# EAGLE schematic module_template_core (EAGLE 5.10)
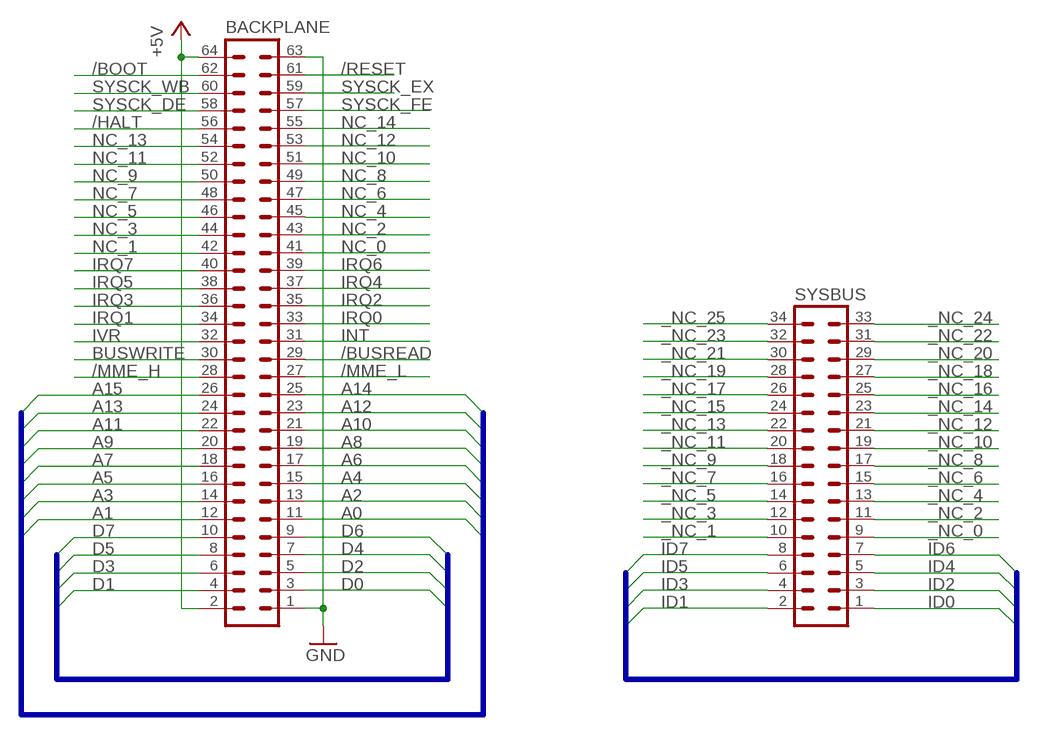
[diagram p0: schematic, sheet 1]

## Parts
BACKPLANE  ML64L  [ML64L]
SYSBUS  ML34L  [ML34L]

## Nets
+5V: BACKPLANE.2 BACKPLANE.64
/BOOT: BACKPLANE.62
/BUSREAD: BACKPLANE.29
/HALT: BACKPLANE.56
/MME_H: BACKPLANE.28
/MME_L: BACKPLANE.27
/RESET: BACKPLANE.61
_NC_0: SYSBUS.9
_NC_1: SYSBUS.10
_NC_2: SYSBUS.11
_NC_3: SYSBUS.12
_NC_4: SYSBUS.13
_NC_5: SYSBUS.14
_NC_6: SYSBUS.15
_NC_7: SYSBUS.16
_NC_8: SYSBUS.17
_NC_9: SYSBUS.18
_NC_10: SYSBUS.19
_NC_11: SYSBUS.20
_NC_12: SYSBUS.21
_NC_13: SYSBUS.22
_NC_14: SYSBUS.23
_NC_15: SYSBUS.24
_NC_16: SYSBUS.25
_NC_17: SYSBUS.26
_NC_18: SYSBUS.27
_NC_19: SYSBUS.28
_NC_20: SYSBUS.29
_NC_21: SYSBUS.30
_NC_22: SYSBUS.31
_NC_23: SYSBUS.32
_NC_24: SYSBUS.33
_NC_25: SYSBUS.34
A0: BACKPLANE.11
A1: BACKPLANE.12
A2: BACKPLANE.13
A3: BACKPLANE.14
A4: BACKPLANE.15
A5: BACKPLANE.16
A6: BACKPLANE.17
A7: BACKPLANE.18
A8: BACKPLANE.19
A9: BACKPLANE.20
A10: BACKPLANE.21
A11: BACKPLANE.22
A12: BACKPLANE.23
A13: BACKPLANE.24
A14: BACKPLANE.25
A15: BACKPLANE.26
BUSWRITE: BACKPLANE.30
D0: BACKPLANE.3
D1: BACKPLANE.4
D2: BACKPLANE.5
D3: BACKPLANE.6
D4: BACKPLANE.7
D5: BACKPLANE.8
D6: BACKPLANE.9
D7: BACKPLANE.10
GND: BACKPLANE.1 BACKPLANE.63
ID0: SYSBUS.1
ID1: SYSBUS.2
ID2: SYSBUS.3
ID3: SYSBUS.4
ID4: SYSBUS.5
ID5: SYSBUS.6
ID6: SYSBUS.7
ID7: SYSBUS.8
INT: BACKPLANE.31
IRQ0: BACKPLANE.33
IRQ1: BACKPLANE.34
IRQ2: BACKPLANE.35
IRQ3: BACKPLANE.36
IRQ4: BACKPLANE.37
IRQ5: BACKPLANE.38
IRQ6: BACKPLANE.39
IRQ7: BACKPLANE.40
IVR: BACKPLANE.32
NC_0: BACKPLANE.41
NC_1: BACKPLANE.42
NC_2: BACKPLANE.43
NC_3: BACKPLANE.44
NC_4: BACKPLANE.45
NC_5: BACKPLANE.46
NC_6: BACKPLANE.47
NC_7: BACKPLANE.48
NC_8: BACKPLANE.49
NC_9: BACKPLANE.50
NC_10: BACKPLANE.51
NC_11: BACKPLANE.52
NC_12: BACKPLANE.53
NC_13: BACKPLANE.54
NC_14: BACKPLANE.55
SYSCK_DE: BACKPLANE.58
SYSCK_EX: BACKPLANE.59
SYSCK_FE: BACKPLANE.57
SYSCK_WB: BACKPLANE.60

## Buses
D[0..7]
A[0..15]
ID[0..7]

## Library data of the parts
BACKPLANE = con-ml:ML64L: HARTING
SYSBUS = con-ml:ML34L: HARTING

## Net classes
0 Signal: width 0.305 mm, drill 0.508 mm, clearance 0.203 mm
1 LoVolt42: width 0.61 mm, drill 0.508 mm, clearance 0.813 mm to class 0, clearance 0.305 mm
2 MedVolt100: width 0.61 mm, drill 0.508 mm, clearance 1.626 mm to class 0, clearance 1.626 mm to class 1, clearance 0.813 mm
3 LineVolt350: width 0.813 mm, drill 0.508 mm, clearance 12.7 mm to class 0, clearance 12.7 mm to class 1, clearance 12.7 mm to class 2, clearance 2.54 mm